# EAGLE schematic servo (EAGLE 8.3.2)

## Sheet 1 of 2
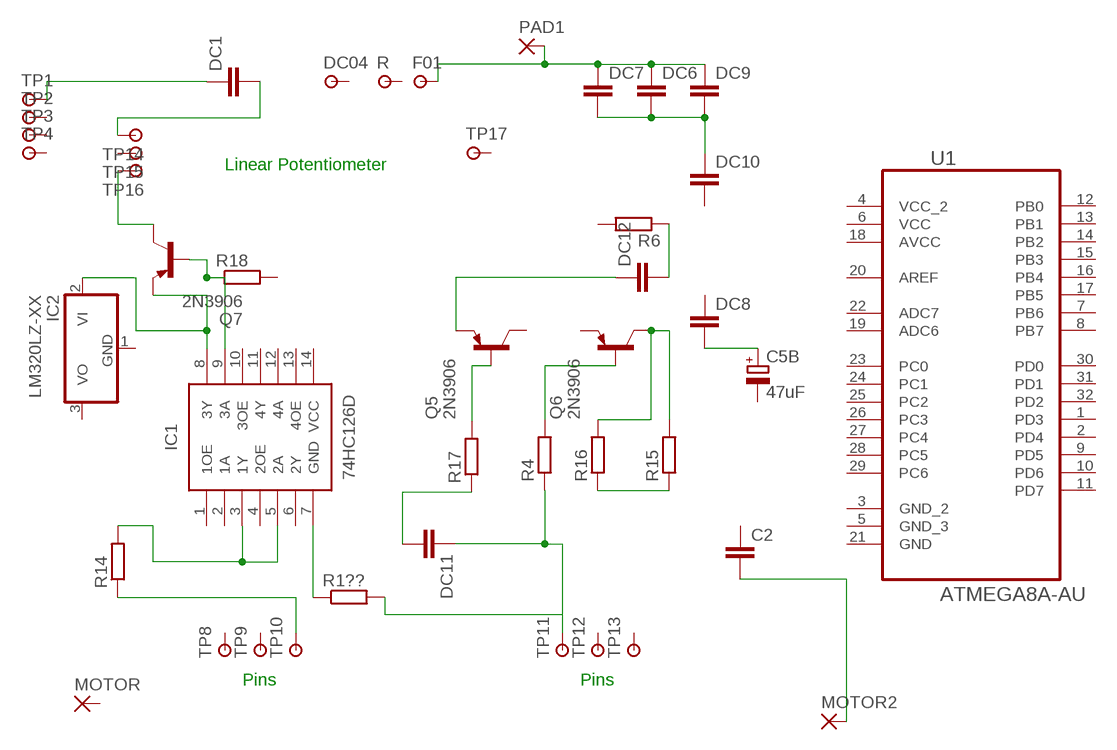
[diagram p0: schematic, sheet 1]

### Parts
C2  C2.5P  [C025-030X050]
C5B  47uF  CPOL1  [E2,5-7---100UF]
DC1  C2.5P  [C025-030X050]
DC04  PAD-TESTPOINT  [1,6/0,8]
DC6  C2.5P  [C025-030X050]
DC7  C2.5P  [C025-030X050]
DC8  C2.5P  [C025-030X050]
DC9  C2.5P  [C025-030X050]
DC10  C2.5P  [C025-030X050]
DC11  C2.5P  [C025-030X050]
DC12  C2.5P  [C025-030X050]
F01  PAD-TESTPOINT  [1,6/0,8]
IC1  74HC126D  [SOIC127P600X175-14N]
IC2  LM320LZ-XX  [TO92]
MOTOR  PAD-TERMINAL  [2,54/1,1]
MOTOR2  PAD-TERMINAL  [2,54/1,1]
PAD1  PAD-TERMINAL  [2,54/1,1]
Q5  2N3906  [TO92]
Q6  2N3906  [TO92]
Q7  2N3906  [TO92]
R  PAD-TESTPOINT  [1,6/0,8]
R1??  R  [0207/10]
R4  R  [0207/10]
R6  R  [0207/10]
R14  R  [0207/10]
R15  R  [0207/10]
R16  R  [0207/10]
R17  R  [0207/10]
R18  R  [0207/10]
TP1  PAD-TESTPOINT  [1,6/0,8]
TP2  PAD-TESTPOINT  [1,6/0,8]
TP3  PAD-TESTPOINT  [1,6/0,8]
TP4  PAD-TESTPOINT  [1,6/0,8]
TP8  PAD-TESTPOINT  [1,6/0,8]
TP9  PAD-TESTPOINT  [1,6/0,8]
TP10  PAD-TESTPOINT  [1,6/0,8]
TP11  PAD-TESTPOINT  [1,6/0,8]
TP12  PAD-TESTPOINT  [1,6/0,8]
TP13  PAD-TESTPOINT  [1,6/0,8]
TP14  PAD-TESTPOINT  [1,6/0,8]
TP15  PAD-TESTPOINT  [1,6/0,8]
TP16  PAD-TESTPOINT  [1,6/0,8]
TP17  PAD-TESTPOINT  [1,6/0,8]
U1  ATMEGA8A-AU  [QFP80P900X900X120-32N]

### Nets
N$1: DC6.1 DC7.1 DC9.1 F01.1(P) PAD1.1(P)
N$2: DC6.2 DC7.2 DC9.2 DC10.1
N$3: IC1.3(1Y) IC1.5(2A) R14.2
N$4: IC1.7(GND) R1??.1
N$5: Q5.2(B) R17.2
N$6: Q6.2(B) R4.2
N$7: R15.1 R16.1
N$8: Q6.1(C) R15.2 R16.2
N$9: IC1.9(3A) Q7.2(B) R18.1
N$10: DC1.1 TP1.1(P)
N$11: R14.1 TP10.1(P)
N$12: R1??.2 TP11.1(P)
N$13: DC11.1 R4.1
N$14: DC11.2 R17.1
N$15: C2.2 MOTOR2.1(P)
N$16: Q7.1(C) TP16.1(P)
N$17: DC12.1 Q5.3(E)
N$18: DC12.2 R6.1
N$19: C5B.+ DC8.2
N$20: DC1.2 TP14.1(P)
N$21: IC1.8(3Y) IC2.2(VI) Q7.3(E)
Unconnected: C2.1 C5B.- DC04.1(P) DC8.1 DC10.2 IC1.1(1OE) IC1.2(1A) IC1.4(2OE) IC1.6(2Y) IC1.10(3OE) IC1.11(4Y) IC1.12(4A) IC1.13(4OE) IC1.14(VCC) IC2.1(GND) IC2.3(VO) MOTOR.1(P) Q5.1(C) Q6.3(E) R6.2 R18.2 R.1(P) TP2.1(P) TP3.1(P) TP4.1(P) TP8.1(P) TP9.1(P) TP12.1(P) TP13.1(P) TP15.1(P) TP17.1(P) U1.1(PD3) U1.2(PD4) U1.3(GND_2) U1.5(GND_3) U1.7(PB6) U1.8(PB7) U1.9(PD5) U1.10(PD6) U1.11(PD7) U1.12(PB0) U1.13(PB1) U1.14(PB2) U1.15(PB3) U1.16(PB4) U1.17(PB5) U1.19(ADC6) U1.20(AREF) U1.21(GND) U1.22(ADC7) U1.23(PC0) U1.24(PC1) U1.25(PC2) U1.26(PC3) U1.27(PC4) U1.28(PC5) U1.29(PC6) U1.30(PD0) U1.31(PD1) U1.32(PD2)

### Notes on the sheet
- Linear Potentiometer
- Pins | Pins

## Sheet 2 of 2
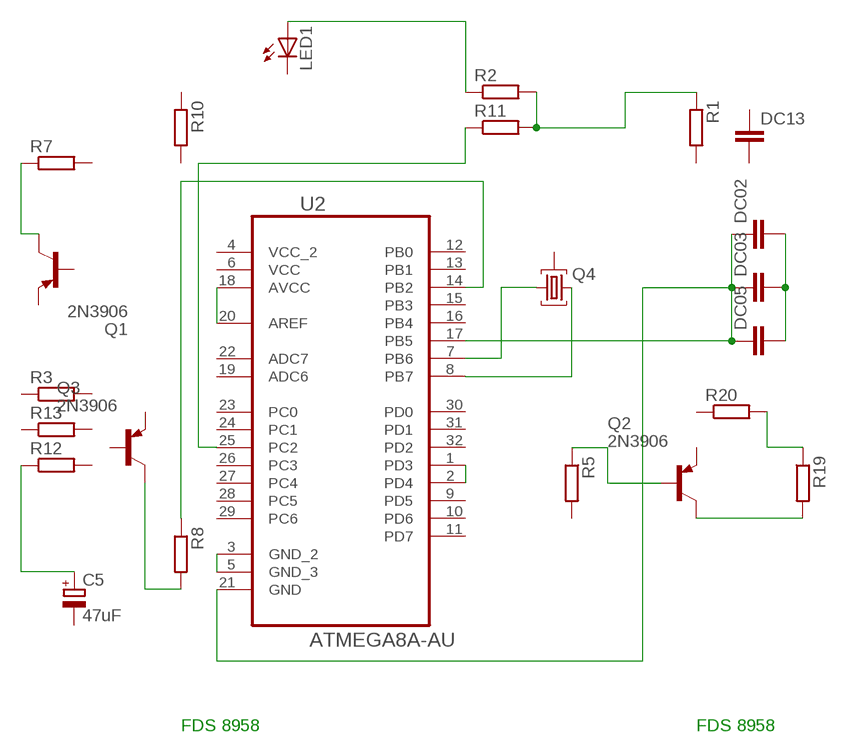
[diagram p1: schematic, sheet 2]

### Parts
C5  47uF  CPOL1  [E2,5-7---100UF]
DC02  C2.5P  [C025-030X050]
DC03  C2.5P  [C025-030X050]
DC05  C2.5P  [C025-030X050]
DC13  C2.5P  [C025-030X050]
LED1  LED3MM  [HLMP-D105]
Q1  2N3906  [TO92]
Q2  2N3906  [TO92]
Q3  2N3906  [TO92]
Q4  HC49GW  [HC49GW]
R1  R  [0207/10]
R2  R  [0207/10]
R3  R  [0207/10]
R5  R  [0207/10]
R7  R  [0207/10]
R8  R  [0207/10]
R10  R  [0207/10]
R11  R  [0207/10]
R12  R  [0207/10]
R13  R  [0207/10]
R19  R  [0207/10]
R20  R  [0207/10]
U2  ATMEGA8A-AU  [QFP80P900X900X120-32N]

### Nets
N$22: U2.1(PD3) U2.2(PD4)
N$23: U2.3(GND_2) U2.5(GND_3)
N$24: Q4.1 U2.7(PB6)
N$25: Q4.2 U2.8(PB7)
N$26: DC02.2 DC03.2 DC05.2
N$27: DC02.1 DC03.1 DC05.1 U2.17(PB5) U2.21(GND)
N$28: U2.18(AVCC) U2.20(AREF)
N$29: R8.1 U2.14(PB2)
N$30: Q2.1(C) R19.2
N$31: Q2.2(B) R5.1
N$32: Q3.1(C) R8.2
N$33: C5.+ R12.1
N$34: Q1.1(C) R7.1
N$35: LED1.A R2.1
N$36: R1.1 R2.2 R11.2
N$37: R11.1 U2.25(PC2)
N$38: R19.1 R20.2
Unconnected: C5.- DC13.1 DC13.2 LED1.K(C) Q1.2(B) Q1.3(E) Q2.3(E) Q3.2(B) Q3.3(E) Q4.3 R1.2 R3.1 R3.2 R5.2 R7.2 R10.1 R10.2 R12.2 R13.1 R13.2 R20.1 U2.9(PD5) U2.10(PD6) U2.11(PD7) U2.12(PB0) U2.13(PB1) U2.15(PB3) U2.16(PB4) U2.19(ADC6) U2.22(ADC7) U2.23(PC0) U2.24(PC1) U2.26(PC3) U2.27(PC4) U2.28(PC5) U2.29(PC6) U2.30(PD0) U2.31(PD1) U2.32(PD2)

### Notes on the sheet
- FDS 8958 | FDS 8958

## Power pins joined to a net without a drawn wire
AVCC: U1.18(AVCC)
VCC: U1.6(VCC) U2.6(VCC)
VCC_2: U1.4(VCC_2) U2.4(VCC_2)

## Library data of the parts
C2 DC1 DC02 DC03 DC05 DC6-DC13 = ee2parts:C: Capacitor
C5 C5B = ee2parts:CPOL: Electrolytic (polarised) capacitor
DC04 F01 R TP1-TP4 TP8-TP17 = ee2parts:PAD-TESTPOINT: SMALL THROUGH-HOLE PAD/TESTPOINT Pad suitable for use as a test point (no pin)
IC1 = 74HC126D:74HC126D: Quad buffer/line driver <https://componentsearchengine.com/Images/3/74HC126D.jpg> Source: Datasheet; DESCRIPTION: Quad buffer/line driver; HEIGHT: mm; MANUFACTURER_NAME: Nexperia; MANUFACTURER_PART_NUMBER: 74HC126D; RS_PART_NUMBER: 7918712; SUPPLIER_NAME: RS
IC2 = linear4:LM320LZ-XX: Negative VOLTAGE REGULATOR
LED1 = ee2parts:LED: LED round, 3mm, 2.54mm lead pitch
MOTOR MOTOR2 PAD1 = ee2parts:PAD-TERMINAL: LARGE THROUGH-HOLE PAD Large pad for mounting PCB pin for convenient prototype off-board connections
Q1-Q3 Q5-Q7 = ee2parts:2N3906: PNP Transistor
Q4 = crystal:HC49GW: CRYSTAL
R1 R1?? R2-R8 R10-R20 = ee2parts:R: Resistor
U1 U2 = Atmel_By_element14_Batch_1-00:ATMEGA8A-AU: Programmable Flash; MPN: ATMEGA8A-AU; OC_FARNELL: 1748532; OC_NEWARK: 26R5638; PACKAGE: TQFP-32; SUPPLIER: Atmel